# Altium schematic sheet 01POWER.SchDoc
size A3; SheetNumber: 1
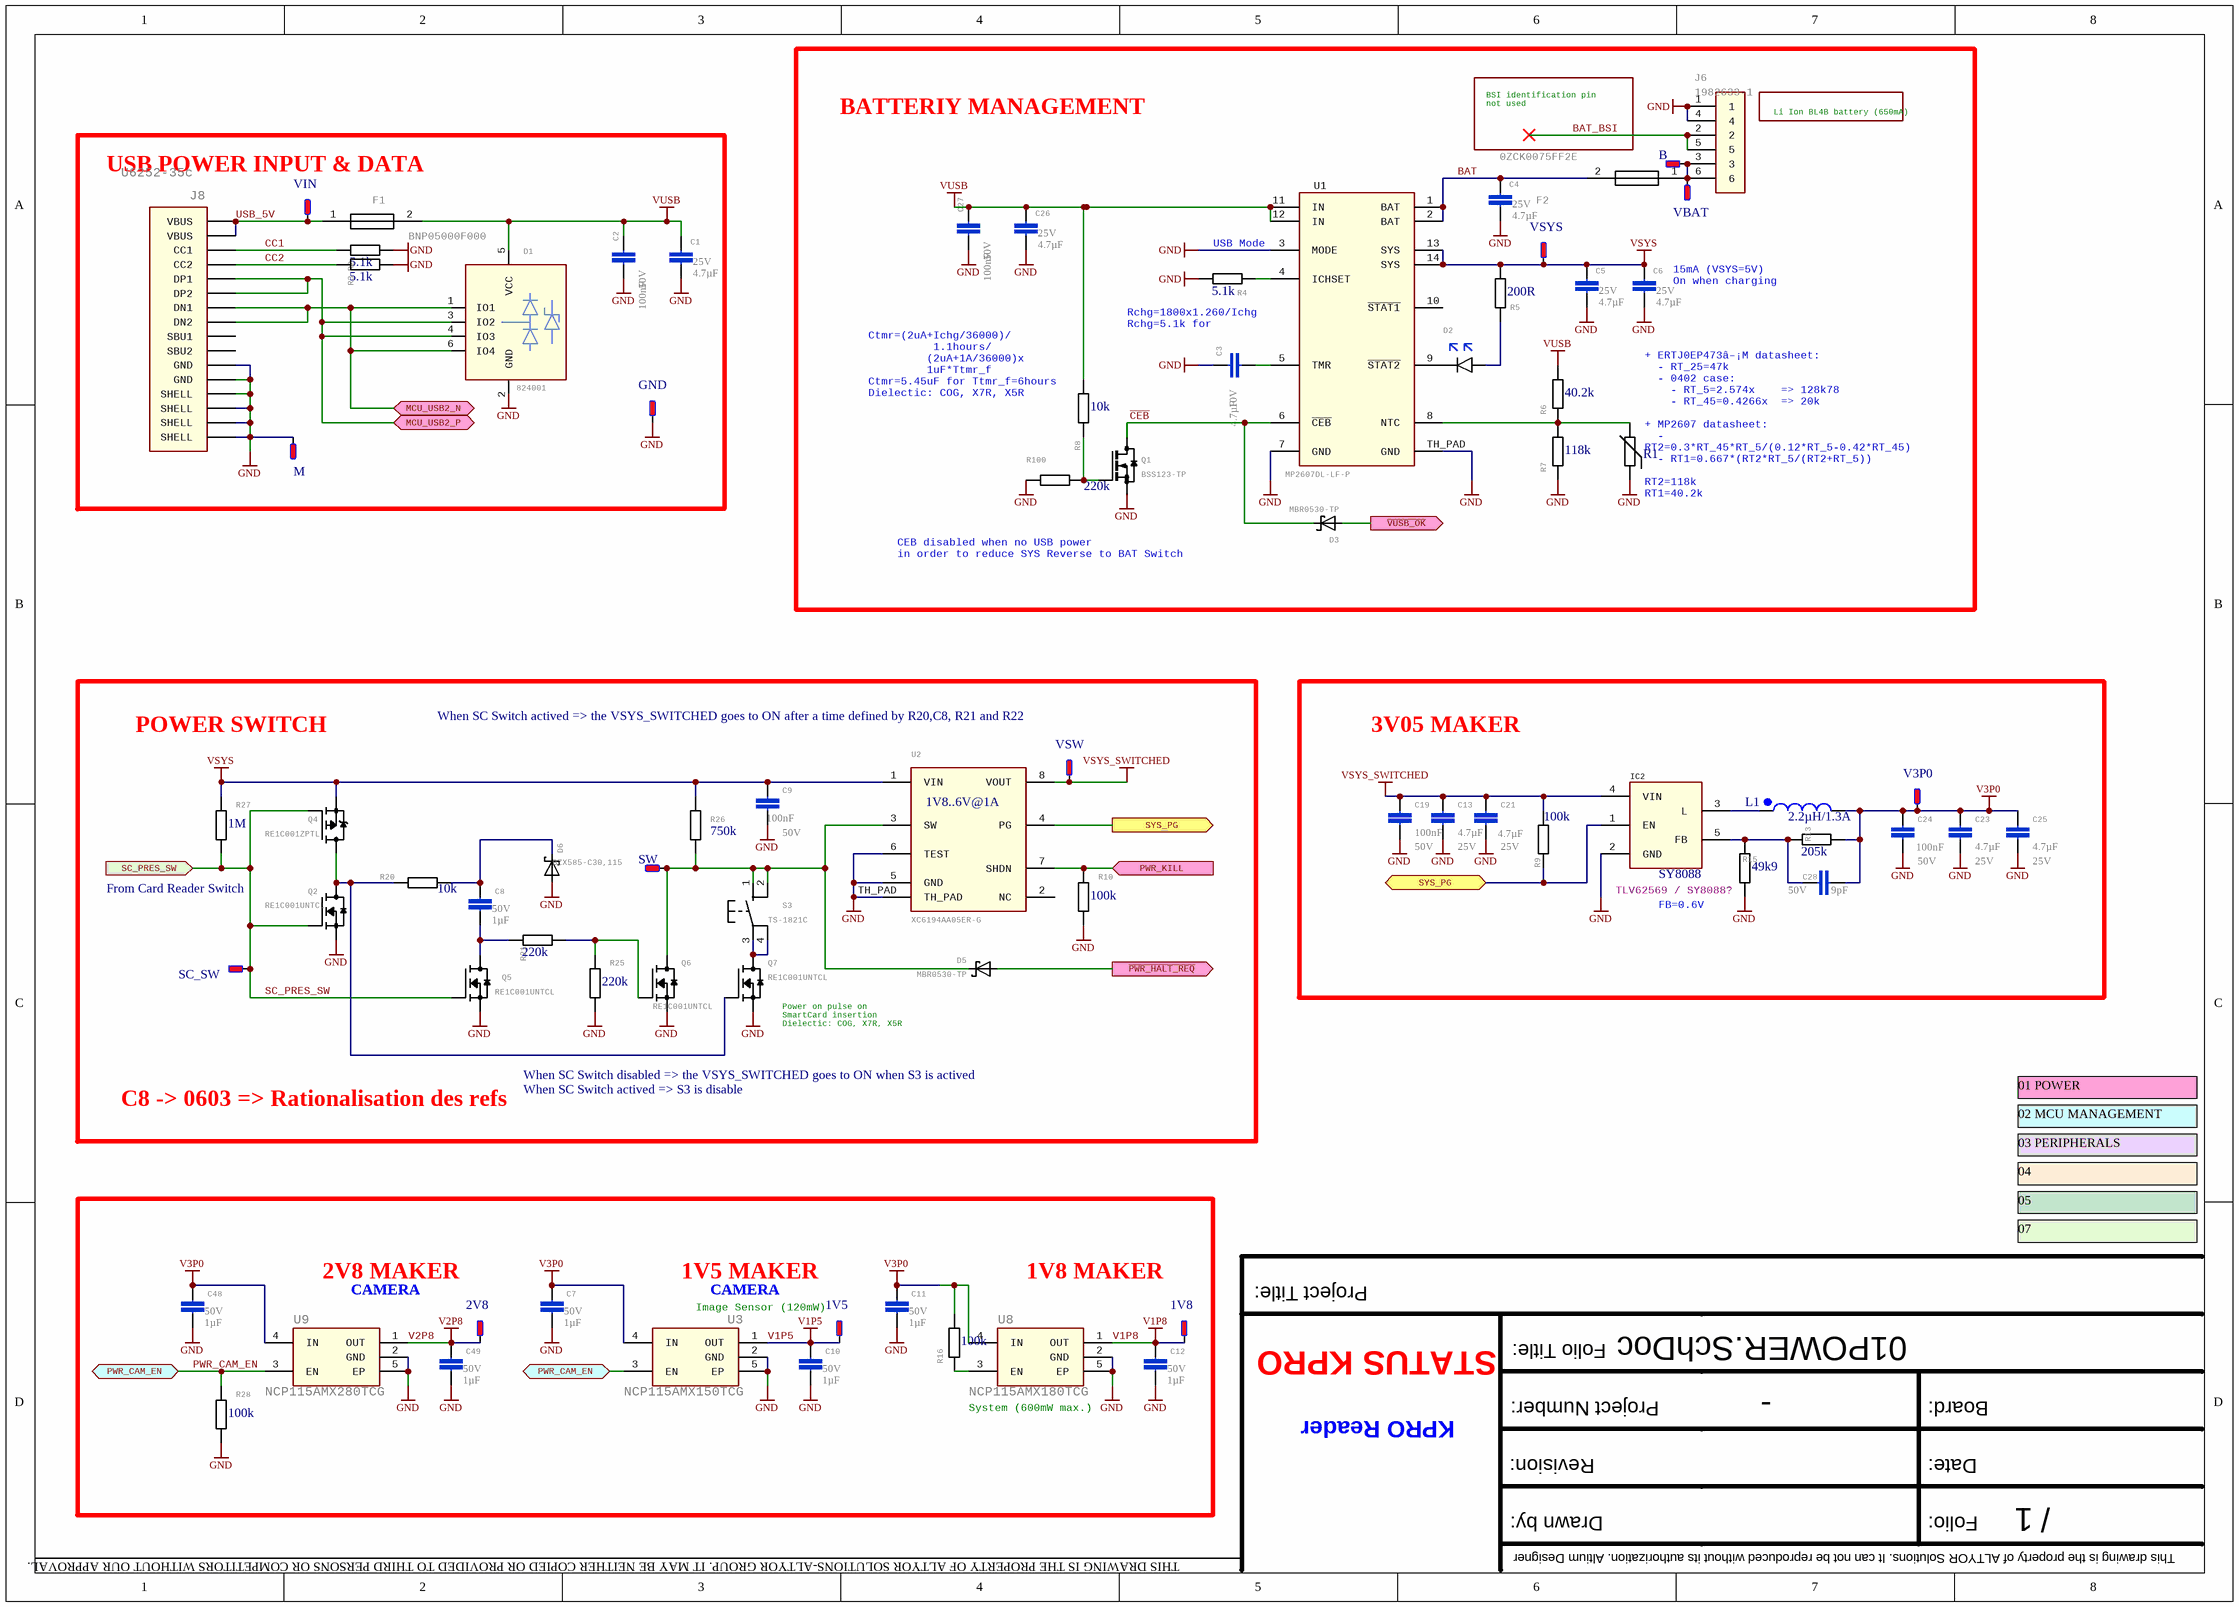
[diagram p0: 01POWER.SchDoc]

## Parts
1V5  TP  [TESTPOINT 1MM]  (value not drawn)  (no BOM)
1V8  TP  [TESTPOINT 1MM]  (value not drawn)  (no BOM)
2V8  TP  [TESTPOINT 1MM]  (value not drawn)  (no BOM)
B  TP  [PLAGE - ROUGE]  (value not drawn)  (no BOM)
C1  VOLTAGE: 25V  NAME: 4.7µF  [0805 - CAPACITOR]  (hidden comment: 0805X475M250CT)
C2  VOLTAGE: 50V  NAME: 100nF  [0402 - CAPACITOR]  (hidden comment: 0402B104K500CT)
C3  VOLTAGE: 10V  NAME: 4.7µF  [0402 - CAPACITOR]  (hidden comment: CC0402KRX5R6BB475)
C4  VOLTAGE: 25V  NAME: 4.7µF  [0805 - CAPACITOR]  (hidden comment: 0805X475M250CT)
C5  VOLTAGE: 25V  NAME: 4.7µF  [0805 - CAPACITOR]  (hidden comment: 0805X475M250CT)
C6  VOLTAGE: 25V  NAME: 4.7µF  [0805 - CAPACITOR]  (hidden comment: 0805X475M250CT)
C7  VOLTAGE: 50V  NAME: 1µF  [0603 - CAPACITOR]  (hidden comment: 0603X105K500CT)
C8  VOLTAGE: 50V  NAME: 1µF  [0603 - CAPACITOR]  (hidden comment: 0603X105K500CT)
C9  VOLTAGE: 50V  NAME: 100nF  [0402 - CAPACITOR]  (hidden comment: 0402B104K500CT)
C10  VOLTAGE: 50V  NAME: 1µF  [0603 - CAPACITOR]  (hidden comment: 0603X105K500CT)
C11  VOLTAGE: 50V  NAME: 1µF  [0603 - CAPACITOR]  (hidden comment: 0603X105K500CT)
C12  VOLTAGE: 50V  NAME: 1µF  [0603 - CAPACITOR]  (hidden comment: 0603X105K500CT)
C13  VOLTAGE: 25V  NAME: 4.7µF  [0805 - CAPACITOR]  (hidden comment: 0805X475M250CT)
C19  VOLTAGE: 50V  NAME: 100nF  [0402 - CAPACITOR]  (hidden comment: 0402B104K500CT)
C21  VOLTAGE: 25V  NAME: 4.7µF  [0805 - CAPACITOR]  (hidden comment: 0805X475M250CT)
C23  VOLTAGE: 25V  NAME: 4.7µF  [0805 - CAPACITOR]  (hidden comment: 0805X475M250CT)
C24  VOLTAGE: 50V  NAME: 100nF  [0402 - CAPACITOR]  (hidden comment: 0402B104K500CT)
C25  VOLTAGE: 25V  NAME: 4.7µF  [0805 - CAPACITOR]  (hidden comment: 0805X475M250CT)
C26  VOLTAGE: 25V  NAME: 4.7µF  [0805 - CAPACITOR]  (hidden comment: 0805X475M250CT)
C27  VOLTAGE: 50V  NAME: 100nF  [0402 - CAPACITOR]  (hidden comment: 0402B104K500CT)
C28  VOLTAGE: 50V  NAME: 9pF  [0402 - CAPACITOR]  (hidden comment: 0402N9R0B500CT)
C48  VOLTAGE: 50V  NAME: 1µF  [0603 - CAPACITOR]  (hidden comment: 0603X105K500CT)
C49  VOLTAGE: 50V  NAME: 1µF  [0603 - CAPACITOR]  (hidden comment: 0603X105K500CT)
D1  824001  [SOT23-6 0.95 Var AA]
D2  LR_Y8SF-U1V2-1  [OSRAM LRY8SFU1V21]  (value not drawn)
D3  MBR0530-TP  [SOD123 DIODE INC]
D5  MBR0530-TP  [SOD123 DIODE INC]
D6  BZX585-C30,115  [SOD523 TOSHIBA]
F1  BNP05000F000  [0805 - FUSE]
F2  0ZCK0075FF2E  [0805 - FUSE]
GND  TP  [TESTPOINT 1MM]  (value not drawn)  (no BOM)
IC2  NAME: SY8088  [SOT23-5 0.95 Var AA]  (hidden comment: SY8088IAAC)
J6  1982633-1  [TE 19826331]
J8  U6252-35c  [ANTENK U6252-35C]
L1  NAME: 2.2µH/1.3A  [CHILISON BWF00252012]  (hidden comment: BWVF002520122R2M00)
M  TP  [PLAGE - NOIRE]  (value not drawn)  (no BOM)
Q1  BSS123-TP  [SOT23-VAR AB]
Q2  RE1C001UNTCL  [SOT-416-3]
Q4  RE1C001ZPTL  [SOT-416-3]
Q5  RE1C001UNTCL  [SOT-416-3]
Q6  RE1C001UNTCL  [SOT-416-3]
Q7  RE1C001UNTCL  [SOT-416-3]
R1  ERT-J0EP473GM  [0402 - RESISTOR]  (value not drawn)
R2  NAME: 5.1k  [0402 - RESISTOR]  (hidden comment: RC0402FR-075K1L)
R3  NAME: 5.1k  [0402 - RESISTOR]  (hidden comment: RC0402FR-075K1L)
R4  NAME: 5.1k  [0402 - RESISTOR]  (hidden comment: RC0402FR-075K1L)
R5  NAME: 200R  [0402 - RESISTOR]  (hidden comment: RC0402FR-07200RL)
R6  NAME: 40.2k  [0402 - RESISTOR]  (hidden comment: RC0402FR-0740K2L)
R7  NAME: 118k  [0402 - RESISTOR]  (hidden comment: RC0402FR-07118KL)
R8  NAME: 10k  [0402 - RESISTOR]  (hidden comment: RC0402FR-0710KL)
R9  NAME: 100k  [0402 - RESISTOR]  (hidden comment: RC0402FR-07100KL)
R10  NAME: 100k  [0402 - RESISTOR]  (hidden comment: RC0402FR-07100KL)
R13  NAME: 205k  [0402 - RESISTOR]  (hidden comment: RC0402FR-07205KL)
R15  NAME: 49k9  [0402 - RESISTOR]  (hidden comment: RC0402FR-0749K9L)
R16  NAME: 100k  [0402 - RESISTOR]  (hidden comment: RC0402FR-07100KL)
R20  NAME: 10k  [0402 - RESISTOR]  (hidden comment: RC0402FR-0710KL)
R21  NAME: 220k  [0402 - RESISTOR]  (hidden comment: RC0402FR-07220KL)
R25  NAME: 220k  [0402 - RESISTOR]  (hidden comment: RC0402FR-07220KL)
R26  NAME: 750k  [0402 - RESISTOR]  (hidden comment: RC0402FR-07750KL)
R27  NAME: 1M  [0402 - RESISTOR]  (hidden comment: RC0201FR-071ML)
R28  NAME: 100k  [0402 - RESISTOR]  (hidden comment: RC0402FR-07100KL)
R100  NAME: 220k  [0402 - RESISTOR]  (hidden comment: RC0402FR-07220KL)
S3  TS-1821C  [SONG TS1821C]
SC_SW  TP  [TESTPOINT 1MM]  (value not drawn)  (no BOM)
SW  TP  [TESTPOINT 1MM]  (value not drawn)  (no BOM)
U1  MP2607DL-LF-P  [QFN14-0.5-3s4]
U2  XC6194AA05ER-G  [TOREX USP-8B06]
U3  NCP115AMX150TCG  [ON SEMI NCV8160AMX330TBG]
U8  NCP115AMX180TCG  [ON SEMI NCV8160AMX330TBG]
U9  NCP115AMX280TCG  [ON SEMI NCV8160AMX330TBG]
V3P0  TP  [TESTPOINT 1MM]  (value not drawn)  (no BOM)
VBAT  TP  [TESTPOINT 1MM]  (value not drawn)  (no BOM)
VIN  TP  [TESTPOINT 1MM]  (value not drawn)  (no BOM)
VSW  TP  [TESTPOINT 1MM]  (value not drawn)  (no BOM)
VSYS  TP  [TESTPOINT 1MM]  (value not drawn)  (no BOM)

## Blocks framed on the sheet
BATTERIY MANAGEMENT: B C3-C6 C26 C27 D2 D3 F2 J6 Q1 R1 R4-R8 R100 U1 VBAT VSYS
USB POWER INPUT & DATA: C1 C2 D1 F1 GND J8 M R2 R3 VIN
3V05 MAKER: C13 C19 C21 C23-C25 C28 IC2 L1 R9 R13 R15 V3P0

## Ports
MCU_USB2_N, MCU_USB2_P, PWR_CAM_EN, PWR_KILL, SC_PRES_SW, SYS_PG, ~{PWR_HALT_REQ}, ~{VUSB_OK}

## Nets
GND: C1.2 C2.2 C3.1 C4.2 C5.2 C6.2 C7.2 C9.2 C10.2 C11.2 C12.2 C13.2 C19.2 C21.2 C23.2 C24.2 C25.2 C26.2 C27.2 C48.2 C49.2 D1.2(GND) D6.A GND.1(PT) IC2.2(GND) J6.1 J6.4 J8.A1_B12(GND) J8.B1_A12(GND) J8.S1(SHELL) J8.S2(SHELL) J8.S3(SHELL) J8.S4(SHELL) M.1(PT) Q1.2(S) Q2.2(S) Q5.2(S) Q6.2(S) Q7.2(S) R1.1 R2.1 R3.1 R4.2 R7.1 R10.1 R15.1 R25.1 R28.1 R100.1 U1.3(MODE) U1.7(GND) U1.TH_PAD(GND) U2.5(GND) U2.6(TEST) U2.TH_PAD U3.2(GND) U3.5(EP) U8.2(GND) U8.5(EP) U9.2(GND) U9.5(EP)
V1P5: 1V5.1(PT) C10.1 U3.1(OUT)
V1P8: 1V8.1(PT) C12.1 U8.1(OUT)
V2P8: 2V8.1(PT) C49.1 U9.1(OUT)
V3P0: C7.1 C11.1 C23.1 C24.1 C25.1 C28.2 C48.1 L1.2 R13.1 R16.1 U3.4(IN) U8.4(IN) U9.4(IN) V3P0.1(PT)
VSYS: C5.1 C6.1 C9.1 Q4.2(S) R5.1 R26.2 R27.2 U1.13(SYS) U1.14(SYS) U2.1(VIN) VSYS.1(PT)
VSYS_SWITCHED: C13.1 C19.1 C21.1 IC2.4(VIN) R9.1 U2.8(VOUT) VSW.1(PT)
VUSB: C1.1 C2.1 C26.1 C27.1 D1.5(VCC) F1.2 R6.2 R8.2 U1.11(IN) U1.12(IN)
BAT: C4.1 F2.2 U1.1(BAT) U1.2(BAT)
BAT_BSI: J6.2 J6.5
~{CEB}: D3.C Q1.3(D) U1.6(~{CEB})
CC1: J8.A5(CC1) R2.2
CC2: J8.B5(CC2) R3.2
MCU_USB2_N: D1.1(IO1) D1.6(IO4) J8.A7(DN1) J8.B7(DN2) ; port MCU_USB2_N
MCU_USB2_P: D1.3(IO2) D1.4(IO3) J8.A6(DP1) J8.B6(DP2) ; port MCU_USB2_P
~{PWR_HALT_REQ}: D5.A ; port ~{PWR_HALT_REQ}
PWR_CAM_EN: R28.2 U3.3(EN) U9.3(EN) ; port PWR_CAM_EN
PWR_KILL: R10.2 U2.7(SHDN) ; port PWR_KILL
SC_PRES_SW: Q2.1(G) Q4.1(G) Q5.1(G) R27.1 SC_SW.1(PT) ; port SC_PRES_SW
SYS_PG: IC2.1(EN) R9.2 U2.4(PG) ; port SYS_PG
USB_5V: F1.1 J8.A4_B9(VBUS) J8.B4_A9(VBUS) VIN.1(PT)
~{VUSB_OK}: D3.A ; port ~{VUSB_OK}
NetB_1: B.1(PT) F2.1 J6.3 J6.6 VBAT.1(PT)
NetC3_2: C3.2 U1.5(TMR)
NetC8_1: C8.1 D6.C R20.2
NetC8_2: C8.2 Q5.3(D) R21.2
NetC28_1: C28.1 IC2.5(FB) R13.2 R15.2
NetD2_1: D2.1(C) U1.9(~{STAT2})
NetD2_2: D2.2(A) R5.2
NetD5_C: D5.C Q6.3(D) R26.1 S3.1(S) S3.2(S1) SW.1(PT) U2.3(SW)
NetIC2_3: IC2.3(L) L1.1
NetQ1_1: Q1.1(G) R8.1 R100.2
NetQ2_3: Q2.3(D) Q4.3(D) Q7.1(G) R20.1
NetQ6_1: Q6.1(G) R21.1 R25.2
NetQ7_3: Q7.3(D) S3.3(P) S3.4(P1)
NetR1_2: R1.2 R6.1 R7.2 U1.8(NTC)
NetR4_1: R4.1 U1.4(ICHSET)
NetR16_2: R16.2 U8.3(EN)

Not connected (* = marked no-connect by the designer): J8 A8(SBU1) B8(SBU2); U1 10(~{STAT1}); U2 2(NC)

## Notes on the sheet
- BSI identification pin
  not used
- Li Ion BL4B battery (650mA)
- USB Mode
- Rchg=1800x1.260/Ichg
  Rchg=5.1k for Ichg=445mA
- (near C6) 15mA (VSYS=5V)
  On when charging
- (near R8) Ctmr=(2uA+Ichg/36000)/
  1.1hours/
  (2uA+1A/36000)x
  1uF*Ttmr_f
  Ctmr=5.45uF for Ttmr_f=6hours
  Dielectic: COG, X7R, X5R
- (near R1) + ERTJ0EP473â–¡M datasheet:
  - RT_25=47k
  - 0402 case:
  - RT_5=2.574x    => 128k78
  - RT_45=0.4266x  => 20k
  + MP2607 datasheet:
  - RT2=0.3*RT_45*RT_5/(0.12*RT_5-0.42*RT_45)
  - RT1=0.667*(RT2*RT_5/(RT2+RT_5))
  RT2=118k
  RT1=40.2k
- CEB disabled when no USB power
  in order to reduce SYS Reverse to BAT Switch Leakage current to 1uA
  Internally pulled up
- POWER SWITCH
- When SC Switch actived => the VSYS_SWITCHED goes to ON after a time defined by R20,C8, R21 and R22
- (near U2) 1V8..6V@1A
- From Card Reader Switch
- TLV62569 / SY8088?
- FB=0.6V
- (near Q7) Power on pulse on
  SmartCard insertion
  Dielectic: COG, X7R, X5R
- C8 -> 0603 => Rationalisation des refs
- When SC Switch disabled => the VSYS_SWITCHED goes to ON when S3 is actived
- When SC Switch actived => S3 is disable
- 01 POWER
- 02 MCU MANAGEMENT
- 03 PERIPHERALS
- 04
- 07
- 05
- 2V8 MAKER
- (near U9) CAMERA
- 1V5 MAKER
- Image Sensor (120mW)
- (near U3) CAMERA
- 1V8 MAKER
- System (600mW max.)
- STATUS KPRO
- Project Title:
- Folio Title:
- KPRO Reader
- Project Number:
- -
- Board:
- Revision:
- Date:
- THIS DRAWING IS THE PROPERTY OF ALTYOR SOLUTIONS-ALTYOR GROUP. IT MAY BE NEITHER COPIED OR PROVIDED TO THIRD PERSONS OR COMPETITORS WITHOUT OUR APPROVAL.
- Drawn by:
- Folio:
- /
- This drawing is the property of ALTYOR Solutions. It can not be reproduced without its authorization. Altium Designer

## Library data of the parts
1V5 1V8 2V8 B GND M SC_SW SW V3P0 VBAT VIN VSW VSYS = TP: Pointe de test 1.27mm; LIBRARY REFERENCE: TP 1.27mm; NAME: 1.27; ERP CODE: 10-*; ERP SF CODE: 16; GENERIC: False; TMAX: N/A; TMIN: N/A
C1 C4-C6 C13 C21 C23 C25 C26 = C-EU-C4.7µF-X5R-6.3V-0805: CAP X5R 4.7µF 25V ±10% 0805; MANUFACTURER: WALSIN; ARTICLE CODE: MSR 791-0805X475M250CT; GENERIC: True; ERP SF CODE: 4; ERP CODE: 10-*; TMAX: 125; TMIN: -55
C2 C9 C19 C24 C27 = C-EU-C100NF-X7R-16V-0402: CAP X7R 100nF 50V ±10% 0402; MANUFACTURER: WALSIN; ARTICLE CODE: MSR 791-0402B104K500CT; GENERIC: True; ERP SF CODE: 4; ERP CODE: 10-*; TMAX: 125; TMIN: -55
C3 = C-EU-C5UF-X7R-6.3V-0402: CAP X5R 4.7µF 10V ±10% 0402; MANUFACTURER: YAGEO; ARTICLE CODE: MSR 603-CC0402KR5R6BB475; GENERIC: True; ERP SF CODE: 4; ERP CODE: 10-*; TMAX: 125; TMIN: -55
C7 C8 C10-C12 C48 C49 = C-EU-C1µF-X5R-6.3V-0603: CAP X5R 1µF 50V ±10% 0603; MANUFACTURER: WALSIN; ARTICLE CODE: MSR 791-0603X105K500CT; GENERIC: True; ERP SF CODE: 4; ERP CODE: 10-*; TMAX: 125; TMIN: -55
C28 = C-EU-C9PF-C0G-50V-0402: CAP COG 9pF 50V ±0.1pF 0402; MANUFACTURER: WALSIN; ARTICLE CODE: MSR 791-0402N220F500CT; GENERIC: True; ERP SF CODE: 4; ERP CODE: 10-*; TMAX: 125; TMIN: -55
D1 = 824001: diode TVS, 82400 Series, Bidirectionelle; MANUFACTURER: Würth; TMAX: 85; ARTICLE CODE: MSR 710-824001; NAME: ESD 5V; ERP CODE: 10-*; TMIN: -55; GENERIC: False
D2 = LR_Y8SF-U1V2-1: Osram Opto Micro SIDELED Series Red LED, 120    Source:  Datasheet; TMIN: -40; TMAX: 100; ARTICLE CODE: MSR 720-LRY8SFU1V21; ERP CODE: 10-*; ERP SF CODE: 5; NAME: LR Y8SF-U1V2-1; GENERIC: Flase; MANUFACTURER: OSRAM
D3 = MBR0530T1G: Schottky Rectifier, 30 V, 500 mA, Single; pin to pad: A>2 C>1; MANUFACTURER: ON SEMI; ARTICLE CODE: MSR 833-MBR0530-TP; ERP CODE: MBR0530-*; GENERIC: False; TMIN: 125; TMAX: -65; NAME: MBR0530
D5 = MBR0530T1G: Schottky Rectifier, 30 V, 500 mA, Single; pin to pad: A>2 C>1; MANUFACTURER: ON SEMI; ARTICLE CODE: MSR 863-MBR0530-TP; ERP CODE: MBR0530-*; GENERIC: False; TMIN: 125; TMAX: -65; NAME: MBR0530
D6 = MBR0530T1G: Zener 3V, 300mW - SOD 523-3; pin to pad: A>2 C>1; MANUFACTURER: NXP; ARTICLE CODE: MSR 771-BZX585-C30115; GENERIC: False; TMIN: 150; TMAX: -65; NAME: 3V
F1 = 0ZCK0050FF2E: FUSE 500mA 6V 0805; MANUFACTURE_CND: '0ZCK0050FF2E/0402L050SLKR; MANUFACTURER: JNHONGBAO; ARTICLE CODE: 530-0ZCK0050FF2E; TMIN: -40; NAME: 500mA@32V; ERP CODE: 10-*; GENERIC: False; TMAX: 85; ERP SF CODE: BNP05000F000
F2 = 0ZCK0075FF2E: PTC Resettable Fuse 0.75A(hold) 1.5A(trip) 6VDC 40A 0.6W 0.2s 0.09Ohm SMD Solder Pad 0805 T/R Automotive   Source:  Datasheet; MANUFACTURER: Bel Circuit Protection; TMIN: -40; TMAX: 85; ARTICLE CODE: MSR 530-0ZCK0075FF2E; GENERIC: False; NAME: 1.5A@6V; ERP CODE: 10-*
IC2 = SILERGY SI8088IAAC: DCDC 2V5..5V5  50µA 1V8..3V3; GENERIC: False; TMAX: 85; ARTICLE CODE: LCSC C479072; TMIN: -40; ERP SF CODE: *; MANUFACTURER: SILERGY
J6 = 1982633-1: Connecteurs carte Ã  carte et mezzanine BATTERY CONN 3 POSITION; MANUFACTURER: TE Connectivity; TMIN: -20; TMAX: 80; ARTICLE CODE: MSR 571-1982633-1; GENERIC: False; NAME: 3pts; ERP CODE: 10-*
J8 = ANTENK U6252-35c: Connecteurs USB USB C Rec 16P 3u" Mid Mnt 1.6mm O-set SMT L = 6.5mm S-Spring; MANUFACTUR_CND: GSB1C4621DS1HR; MANUFACTURER: ANTENK; TMAX: 85; GENERIC: False; ERP CODE: 10-*; NAME: USB-C; TMIN: -25
L1 = CDRH5D28NP-100NC: IND 2.2µH, 20%, 1.8A 68mOhm 1MHz - 2.5x2; MANUFACTURER: CHILISIN; ARTICLE CODE: LCSC C2838263; ERP SF CODE: 07; ERP CODE: 10-*; Tmax: +125; Tmin: -40; GENERIC: False
Q1 = BSS123: MOS N 100V 170mA Rds6R - SOT23; MANUFACTURER: MCC; GENERIC: False; ARTICLE CODE: MSR 889-BSS123-TP; TMAX: 150; TMIN: -55; NAME: BSS123-TP
Q2 Q5-Q7 = RE1C001UNTCL: MOS N 20V 100mA Rds3.5R; MANUFACTURER: ROHM SEMI; TMIN: -55; ARTICLE CODE: MSR 755-RE1C001UNTCL; TMAX: 150; ERP CODE: 10-*; GENERIC: False; NAME: RE1C001UNTCL
Q4 = RE1C001ZPTL: MOS P 20V 100mA Rds3.8R; MANUFACTURER: ROHM SEMI; GENERIC: False; ARTICLE CODE: MSR 755-RE1C001ZPTL; TMIN: -55; TMAX: 150; NAME: RE1C001ZPTL
R1 = ERT-J0EP473GM: CTN 47k 2% B(25/50) 4050K 0/+1% - 0402; MANUFACTURER: PANASONIC; ARTICLE CODE: MSR 667-ERT-J0EP473GM; ERP SF CODE: 07; ERP CODE: 10-*; Tmax: +125; Tmin: -40; GENERIC: False; NAME: NTC-47k
R2 R3 = R-EU-R5.1K-1%-0402: RES 5.1k 63mW 1% 0402; MANUFACTURER: YAGEO; ARTICLE CODE: MSR 603-RC0402FR-075K1L; GENERIC: True; TMIN: -55; TMAX: 150
R4 = R-EU-R4.53K-1%-0402: RES 5.1k 63mW 1% 0402; MANUFACTURER: YAGEO; ARTICLE CODE: MSR 603-RC0402FR-075K1L; GENERIC: True; TMIN: -55; TMAX: 150
R5 = R-EU-R200-1%-0402: RES 200R 63mW 1% 0402; MANUFACTURER: YAGEO; ARTICLE CODE: MSR 603-RC0402FR-07200rL; GENERIC: True; TMIN: -55; TMAX: 150
R6 = R-EU-R40.2K-1%-0402: RES 40.2k 63mW 1% 0402; MANUFACTURER: YAGEO; ARTICLE CODE: MSR 603-RC0402FR-0740K2L; GENERIC: True; TMIN: -55; TMAX: 150
R7 = R-EU-R118K-1%-0402: RES 118k 63mW 1% 0402; MANUFACTURER: YAGEO; ARTICLE CODE: MSR 603-RC0402FR-07118KL; GENERIC: True; TMIN: -55; TMAX: 150
R8 R20 = R-EU-R10K-1%-0402: RES 10k 63mW 1% 0402; MANUFACTURER: YAGEO; ARTICLE CODE: MSR 603-RC0402FR-0710KL; GENERIC: True; TMIN: -55; TMAX: 150
R9 R10 R16 R28 = R-EU-R100K-1%-0402: RES 100k 63mW 1% 0402; MANUFACTURER: YAGEO; ARTICLE CODE: MSR 603-RC0402FR-07100KL; GENERIC: True; TMIN: -55; TMAX: 150
R13 = R-EU-R100K-1%-0402: RES 205k 63mW 1% 0402; MANUFACTURER: YAGEO; ARTICLE CODE: MSR 603-RC0402FR-07205KL; GENERIC: True; TMIN: -55; TMAX: 150
R15 = R-EU-R100K-1%-0402: RES 49k9 63mW 1% 0402; MANUFACTURER: YAGEO; ARTICLE CODE: MSR 603-RC0402FR-0749K9L; GENERIC: True; TMIN: -55; TMAX: 150
R21 R25 R100 = R-EU-R220K-1%-0402: RES 220k 63mW 1% 0402; MANUFACTURER: YAGEO; ARTICLE CODE: MSR 603-RC0402FR-07220KL; GENERIC: True; TMIN: -55; TMAX: 150
R26 = R-EU-R750K-1%-0402: RES 750k 63mW 1% 0402; MANUFACTURER: YAGEO; ARTICLE CODE: MSR 603-RC0402FR-07750KL; GENERIC: True; TMIN: -55; TMAX: 150
R27 = R-EU-R1M-1%-0402: RES 1M 63mW 1% 0402; MANUFACTURER: YAGEO; ARTICLE CODE: MSR 603-RC0201FR-071ML; GENERIC: True; TMIN: -55; TMAX: 150
S3 = 434331013822: Interrupteurs de contact WS-TASU SMD Switch 3.5x2.9 x1.35mm; MANUFACTURER: SONG; GENERIC: False; ERP CODE: 10-*; TMIN: -40; TMAX: 85; MANUFACTURE_CND: 434331013822; NAME: 434331013822
U1 = MP2607DL-LF-P: Li + LINEAR Charger WithSystem Power Path Management; MANUFACTURER: MPS; GENERIC: False; ARTICLE CODE: MSR 946-MP2607DLLFP; ERP CODE: 10-*; TMIN: -40; TMAX: 125; NAME: MP2607DL-LF-P
U2 = XC6194AA05ER-G: Power saving Push Button Load switch; MANUFACTURER: TOREX; GENERIC: False; TMIN: -40; ARTICLE CODE: MSR 865-XC6194AA05ER-G; ERP CODE: 10-*; NAME: XC6192AA05ER-G; TMAX: 85
U3 = NCP115AMX150TCG: LDO Regulator - High PSRR - 300mA - Input Voltage 1.7V/5.5V - Ouput Voltage 1.5V; MANUFACTURER: ON SEMI; GENERIC: False; TMAX: 85; ARTICLE CODE: MSR 863-NCP115AMX150TCG; ERP CODE: 10-*; ERP SF CODE: 11; NAME: NCP115 1V5; TMIN: -40
U8 = NCP115AMX180TCG: LDO Regulator - High PSRR - 300mA - Input Voltage 1.7V/5.5V - Ouput Voltage 1.8V; MANUFACTURER: ON SEMI; TMAX: 85; ARTICLE CODE: MSR 863-NCP115AMX180TCG; GENERIC: Flase; ERP CODE: 10-*; ERP SF CODE: 11; NAME: NCP115 1V8; TMIN: -40
U9 = NCP115AMX280TCG: LDO Regulator - High PSRR - 300mA - Input Voltage 1.7V/5.5V - Ouput Voltage 2.8V; MANUFACTURER: ON SEMI; GENERIC: Flase; ARTICLE CODE: MSR 863-NCP115AMX280TCG; ERP SF CODE: 11; NAME: NCP115 2V8; ERP CODE: 10-*; TMIN: -40; TMAX: 85